# EasyEDA Pro project _天猛星MSPM0电赛1.0_2025-07-10.epro, schematic Schematic1
Board Name: Board1; Create Date: 2025-07-05; Page Name: P1; Project Name: 天猛星MSPM0电赛; Schematic Name: Schematic1; Update Date: 2025-07-05; Company: 嘉立创EDA; Page Size: A4; Version: V1.0
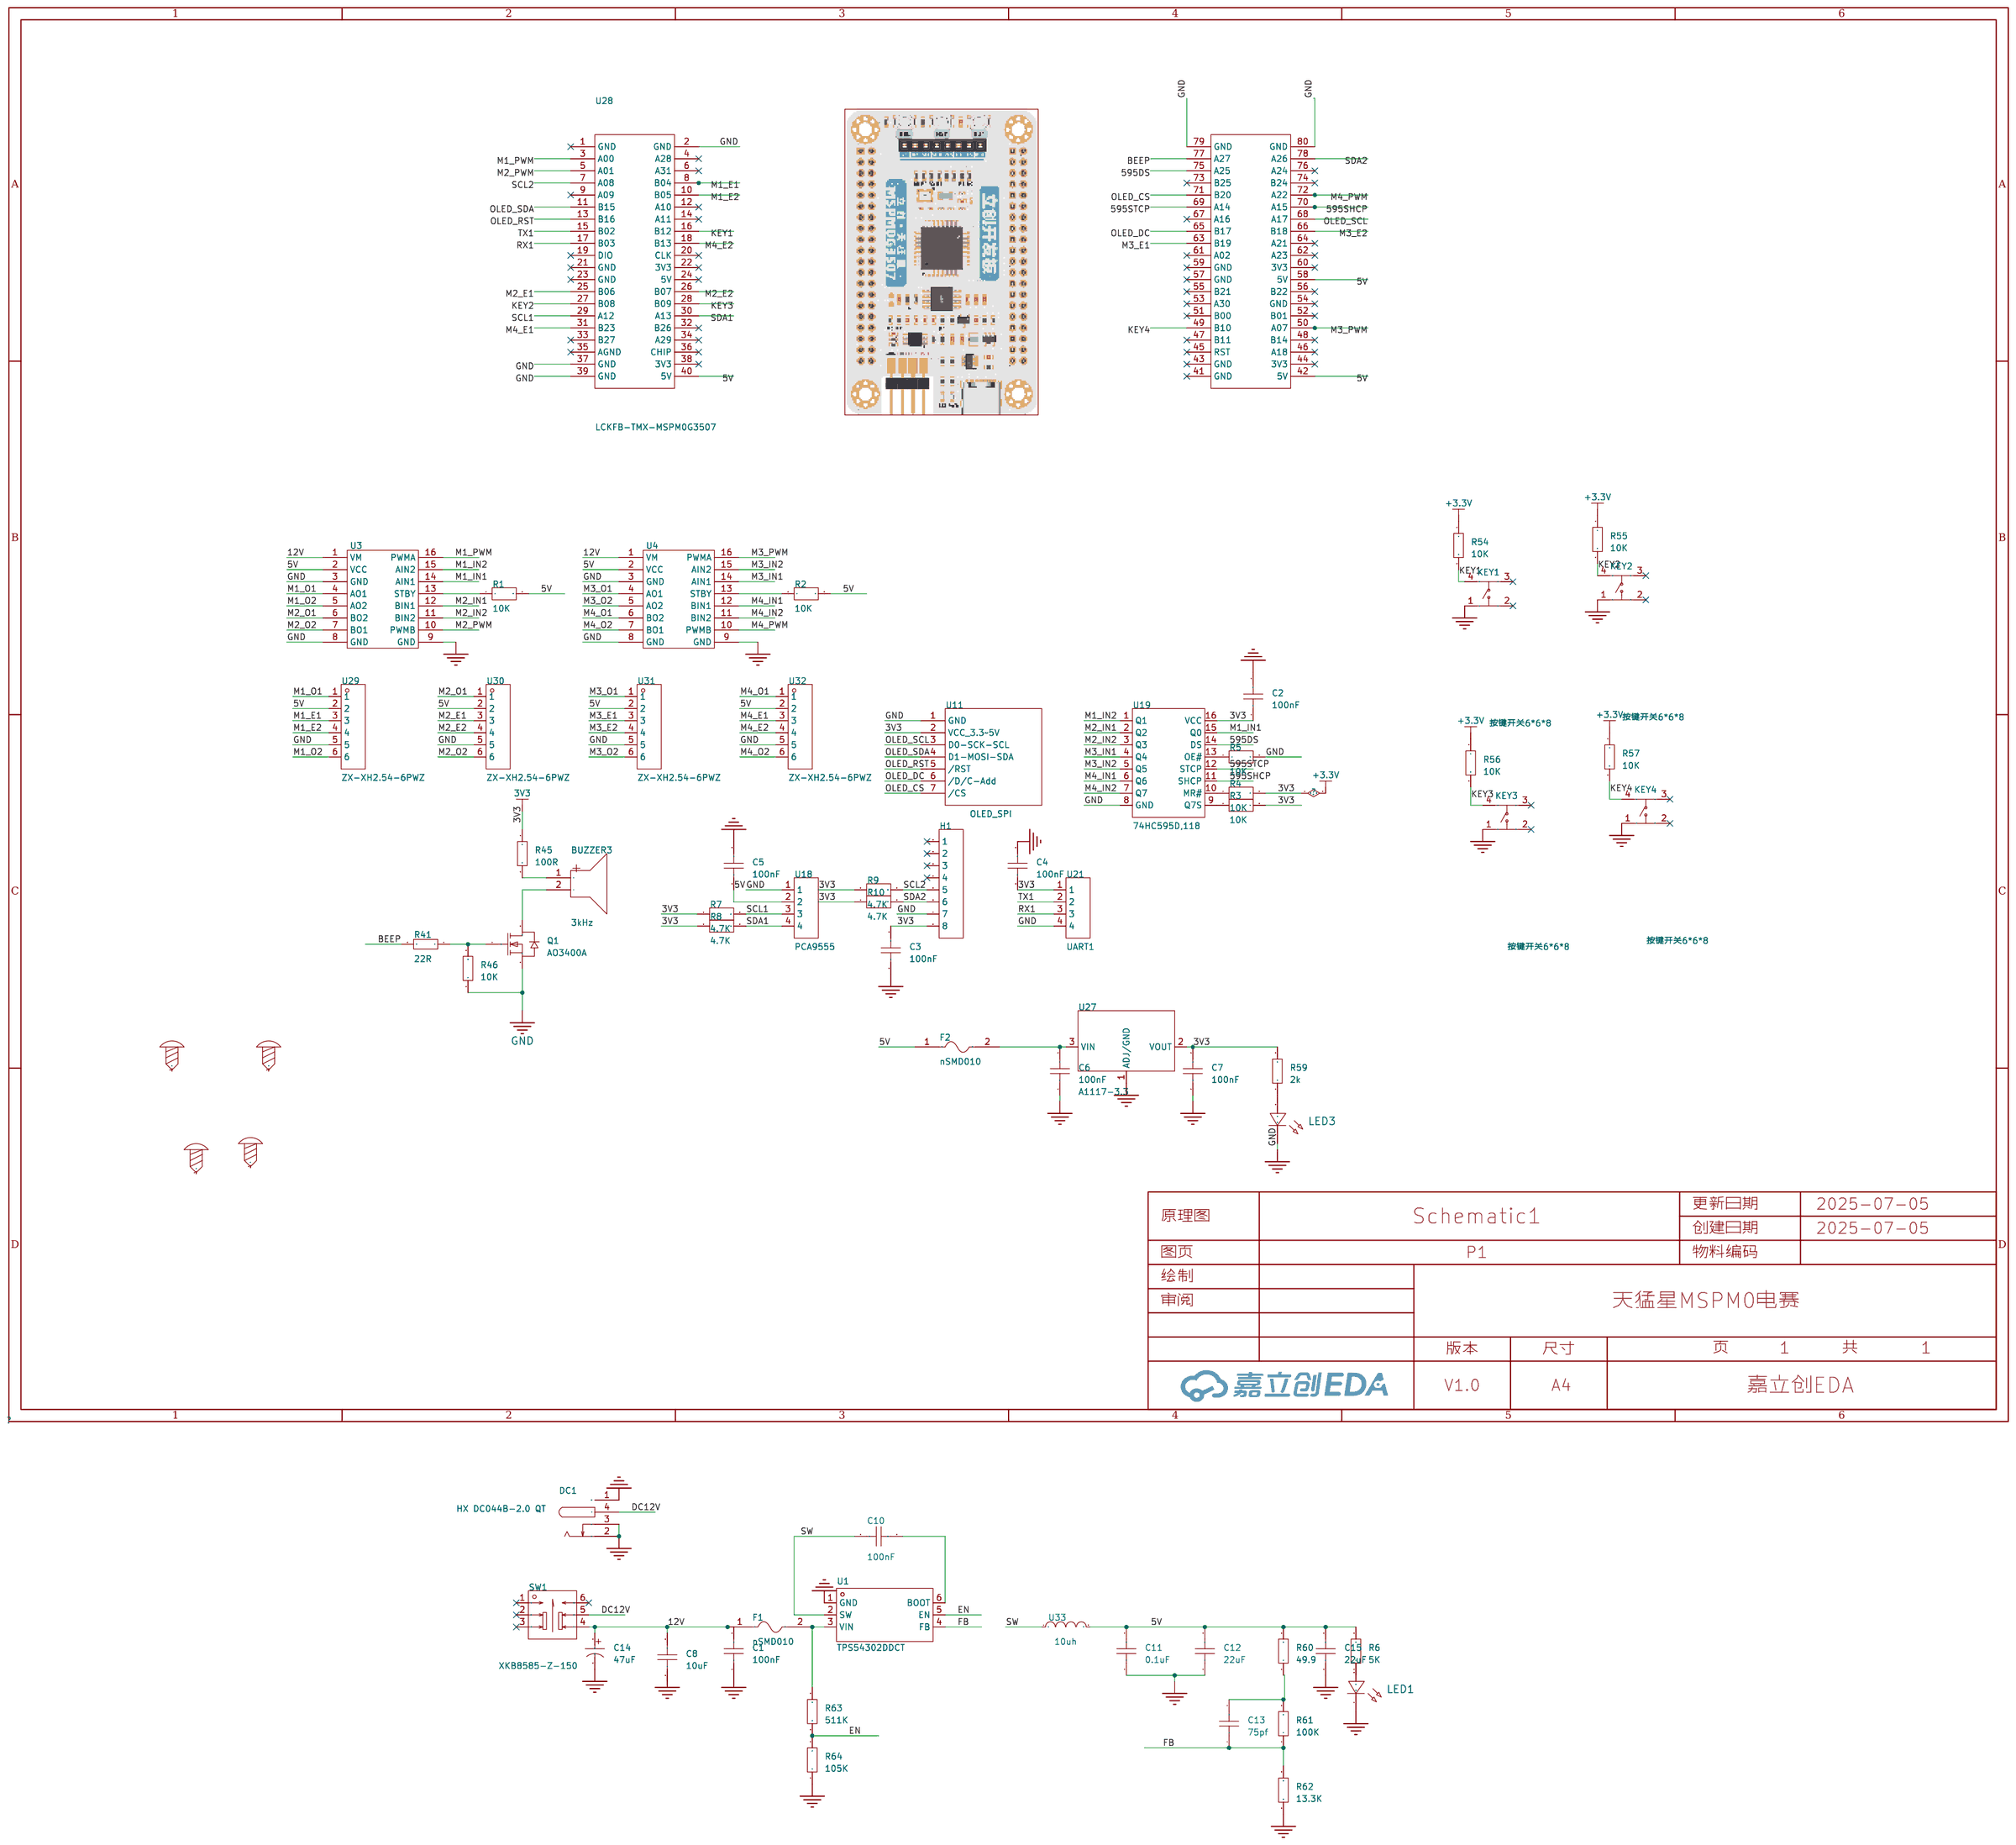
[diagram p0: schematic sheet]

## Parts
BUZZER3  3kHz  [BUZ-TH_BD9.0-P5.00-D0.6-FD]
C1  100nF  [C0805]
C2  100nF  [C0603]
C3  100nF  [C0603]
C4  100nF  [C0603]
C5  100nF  [C0603]
C6  100nF  [C0603]
C7  100nF  [C0603]
C8  10uF  [C0805]
C10  100nF  [C0805]
C11  0.1uF  [C0603]
C12  22uF  [C0603]
C13  75pf  [C0805]
C14  47uF  [CAP-TH_BD5.0-P2.00-D0.8-FD]
C15  22uF  [C0603]
DC1  HX DC044B-2.0 QT  [DC-IN-TH_HX-DC044B-2.0-QT]
F1  nSMD010  [F1206]
F2  nSMD010  [F1206]
H1  -  [HDR-TH_8P-P2.54-V-F-1]
KEY1  按键开关6*6*8  [KEY-TH_4P-L6.0-W6.0-P4.50-LS7.5]
KEY2  按键开关6*6*8  [KEY-TH_4P-L6.0-W6.0-P4.50-LS7.5]
KEY3  按键开关6*6*8  [KEY-TH_4P-L6.0-W6.0-P4.50-LS7.5]
KEY4  按键开关6*6*8  [KEY-TH_4P-L6.0-W6.0-P4.50-LS7.5]
LED1  -  [LED_0805]
LED3  -  [LED_0603]
Q1  AO3400A  [SOT-23-3_L2.9-W1.3-P1.90-LS2.4-BR]
R1  10K  [C0603]
R2  10K  [C0603]
R3  10K  [C0603]
R4  10K  [C0603]
R5  10K  [C0603]
R6  5K  [R0805]
R7  4.7K  [C0603]
R8  4.7K  [C0603]
R9  4.7K  [C0603]
R10  4.7K  [C0603]
R41  22R  [R0603]
R45  100R  [R0603]
R46  10K  [R0603]
R54  10K  [R0603]
R55  10K  [R0603]
R56  10K  [R0603]
R57  10K  [R0603]
R59  2k  [R0603]
R60  49.9  [R0805]
R61  100K  [R0805]
R62  13.3K  [R0805]
R63  511K  [R0805]
R64  105K  [R0805]
SCREW1  -  [M3螺丝]
SCREW2  -  [M3螺丝]
SCREW3  -  [M3螺丝]
SCREW4  -  [M3螺丝]
SW1  XKB8585-Z-150  [SW-TH_6P-L8.5-W8.5-P2.50-LS5.4-BL-1]
U1  TPS54302DDCT  [TSOT-23-6_L2.9-W1.6-P0.95-LS2.8-BR]
U3  -  [TB6612]
U4  -  [TB6612]
U11  OLED_SPI  [0.96OLED_7P]
U18  PCA9555  [CONN-TH_4P-P2.50-XH2.54-4P]
U19  74HC595D,118  [SOIC-16_L9.9-W3.9-P1.27-LS6.0-BL]
U21  UART1  [CONN-TH_4P-P2.50-XH2.54-4P]
U27  A1117-3.3  [SOT-223-3_L6.5-W3.4-P2.30-LS7.0-BR-1]
U28  LCKFB-TMX-MSPM0G3507  [COMM-TH_LCKFB-TMX-MSPM0G3507]
U29  ZX-XH2.54-6PWZ  [CONN-TH_6P-P2.50_ZX-XH2.54-6PWZ]
U30  ZX-XH2.54-6PWZ  [CONN-TH_6P-P2.50_ZX-XH2.54-6PWZ]
U31  ZX-XH2.54-6PWZ  [CONN-TH_6P-P2.50_ZX-XH2.54-6PWZ]
U32  ZX-XH2.54-6PWZ  [CONN-TH_6P-P2.50_ZX-XH2.54-6PWZ]
U33  10uh  [IND-SMD_L4.5-W4.0_SCD0403T]

## Library data of the parts
BUZZER3 = HNB09A03: 驱动方式:有源(内含驱动线路);构造类型:电磁式;频率:3kHz;声压(SPL):85dB;; LCSC Part Name: 电磁式有源一体蜂鸣器HNB09A03; Supplier Part: C96102; Manufacturer: 华能; Supplier Footprint: 插件,D=9mm; JLCPCB Part Class: 扩展库; Datasheet: https://atta.szlcsc.com/upload/public/pdf/source/20241128/61C4C8C3938BB25F7C38FBE94CCE8DCF.pdf; Supplier: LCSC; Driver Circuitry: 有源(内含驱动线路); Technology: 电磁式; Voltage - Supply: 1.5V~4.5V; Current Consumption: 30mA; Sound Pressure Level(SPL): 85dB; Diameter(φD): 9mm; Height: 5.5mm; Operating Temperature: -20℃~+70℃
C1 C8 C10 C13 = CAP_0805: Supplier Footprint: 0805
C2-C7 C11 C12 C15 = CAP_0603: Supplier Footprint: 0603
C14 = EWH1VM470D11OT: 容值:47uF;精度:±20%;额定电压:35V;纹波电流:90mA@120Hz;等效串联电阻:-;; LCSC Part Name: 47uF ±20% 35V; Supplier Part: C105335; Manufacturer: AISHI(艾华集团); Supplier Footprint: 插件,D5xL11mm; Datasheet: https://atta.szlcsc.com/upload/public/pdf/source/20200106/C481308_16D735F9103482ADD8491C667D201AFA.pdf; Supplier: LCSC; Tolerance: ±20%; Rated Voltage: 35V; Ripple Current: 90mA@120Hz; Lead Spacing: 2mm; φD: 5mm; L: 11mm; Lifetime @ Temp: 2000hrs@105℃
DC1 = HX DC044B-2.0 QT: 连接器类型:DC电源插座;安装方式:弯插;触点内径:2mm;触点外径:5.8mm;额定电压:30V;触头材质:-;触头镀层:-;工作温度范围:-;焊接温度(最大值):-;; LCSC Part Name: DC电源插座 内径:2mm 外径:5.8mm; Supplier Part: C41375962; Manufacturer: hanxia(韩下); Supplier Footprint: 插件; Datasheet: https://atta.szlcsc.com/upload/public/pdf/source/20240830/7C11609858F94C5A32999C6C6EF5F6BF.pdf; Supplier: LCSC; Connector Type: DC电源插座; Mounting Style: 弯插; Inside Contact Diameter: 2mm; Outside Contact Diameter: 5.8mm; Voltage Rating (Max): 30V
F1 F2 = nSMD010: 耐压:60V;最大电流:40A;保持电流(Ih):100mA;跳闸电流:250mA;; LCSC Part Name: 0.10A 60V 自恢复保险丝; Supplier Part: C70065; Manufacturer: 台湾陆海; Supplier Footprint: 1206; Datasheet: https://atta.szlcsc.com/upload/public/pdf/source/20230404/ADB19886462D98F83AD677B1F8114E76.pdf; Supplier: LCSC; Voltage - Max: 60V; Current - Max: 40A; Hold Current: 100mA; Trip Current: 250mA; Power Dissipation: -；-；-；-; Operating Temperature: -40℃~+85℃
H1 = HDR-F_2.54_1x8P: Supplier Part: C27438; Supplier Footprint: 插件
KEY1-KEY4 = 按键开关6*6*8: LCSC Part Name: 按键开关6*6*8   直插; Supplier Part: C59982; Supplier Footprint: 插件; JLCPCB Part Class: 扩展库; Supplier: LCSC
LED1 = LED_0805-R: Supplier Footprint: 0805
LED3 = LED_0603-R: Supplier Footprint: 0603
Q1 = AO3400A_C20917: 类型:1个N沟道;漏源电压(Vdss):30V;连续漏极电流(Id):5.7A;导通电阻(RDS(on)@Vgs,Id):26.5mΩ@10V,5.7A;功率(Pd):1.4W;阈值电压(Vgs(th)@Id):1.5V@250uA;; LCSC Part Name: 1个N沟道 耐压:30V 电流:5.7A; Supplier Part: C20917; Manufacturer: AOS; Supplier Footprint: SOT-23-3L; JLCPCB Part Class: 基础库; Datasheet: https://atta.szlcsc.com/upload/public/pdf/source/20140107/1457706668533.pdf; Supplier: LCSC; Type: 1个N沟道; Drain Source Voltage (Vdss): 30V; Continuous Drain Current (Id): 5.7A; Drain Source On Resistance (RDS(on)@Vgs,Id): 26.5mΩ@10V,5.7A; Power Dissipation (Pd): 1.4W; Gate Threshold Voltage (Vgs(th)@Id): 1.5V@250uA; Total Gate Charge (Qg@Vgs): 7nC@4.5V; Input Capacitance (Ciss@Vds): 630pF@15V; Operating Temperature: -55℃~+150℃@(Tj)
R1-R5 R7-R10 = RGT1608P-4990-B-T5: 电阻类型:薄膜电阻;阻值:499Ω;精度:±0.1%;功率:62.5mW;最大工作电压:100V;温度系数:±25ppm/℃;; LCSC Part Name: 薄膜电阻 499Ω ±0.1% 62.5mW; Supplier Part: C2083102; Manufacturer: SUSUMU; Supplier Footprint: 0603; JLCPCB Part Class: 扩展库; Datasheet: https://atta.szlcsc.com/upload/public/pdf/source/20210602/FAF6903AD06801EB9B5BD9535AC54790.pdf; Supplier: LCSC; Type: 薄膜电阻; Tolerance: ±0.1%; Power(Watts): 62.5mW; Overload Voltage (Max): 100V; Temperature Coefficient: ±25ppm/℃; Operating Temperature Range: -55℃~+175℃
R6 R60-R64 = Res_0805: Supplier Footprint: 0805
R41 R45 R46 R54-R57 R59 = Res_0603: Supplier Footprint: 0603
SCREW1-SCREW4 = M3螺丝: Supplier Footprint: 插件
SW1 = XKB8585-Z-150: 电路结构:-;自锁/无锁:自锁;安装方式:直插;触点电流:100mA;额定电压 (AC):250V;额定电压 (DC):30V;带灯:不带;作用力:160gf;机械寿命:10万次;; LCSC Part Name: 按键开关   六脚 内扣 有声自锁; Supplier Part: C318850; Manufacturer: XKB Connectivity(中国星坤); Supplier Footprint: 插件; JLCPCB Part Class: 扩展库; Datasheet: https://atta.szlcsc.com/upload/public/pdf/source/20200227/C318850_BEC742BC33DEE736D7E5FB22B903A157.pdf; Supplier: LCSC; Self Lock / No Lock: 自锁; Actuator Style: 方形按钮; Mounting Style: 直插; Contact Current: 100mA; Voltage Rating (AC): 250V; Voltage Rating (DC): 30V; Insulation Resistance: 100MΩ; Actuator/Cap Color: 白色; With Lamp: 不带; Pin Style: PC引脚; Operating Force: 160gf; Operating Temperature: -15℃~+55℃; Mechanical Life: 10万次
U1 = TPS54302DDCT: 功能类型:降压型;输出类型:可调;工作电压:4.5V~28V;输出电压:596mV~28V;输出电流:3A;; LCSC Part Name: 4.5V至28V输入,3A输出,低EMI同步降压转换器; Supplier Part: C129370; Manufacturer: TI(德州仪器); Supplier Footprint: TSOT-23-6; JLCPCB Part Class: 扩展库; Datasheet: https://www.ti.com/cn/lit/gpn/tps54302; Supplier: LCSC; Function: 降压型; Output Type: 可调; Input Voltage: 4.5V~28V; Output Voltage: 596mV~28V; Output Current: 3A; Switching Frequency: 400kHz; Operating Temperature: -40℃~+125℃@(TJ); Synchronous Rectification: 是; Number of Outputs: 1; Topology: 降压式; Switch tube (built-in/external): 内置
U3 U4 = TB6612
U11 = OLED_7P: Pin Type: IN
U18 U21 = XH2.54_4P_直插: Supplier Part: C9900008616; Supplier Footprint: XH2.54_4P; JLCPCB Part Class: 扩展库; Supplier: LCSC
U19 = 74HC595D,118: 功能:串行至串行或并行;电源电压:2V~6V;元件数:1;每个元件位数:8;; LCSC Part Name: 三态输出 串行至串行或并行移位寄存器; Supplier Part: C5947; Manufacturer: Nexperia(安世); Supplier Footprint: SOIC-16; JLCPCB Part Class: 基础库; Datasheet: https://atta.szlcsc.com/upload/public/pdf/source/20240724/C3A3241CA190230F407C83CEC4244600.pdf; Supplier: LCSC; Function: 串行至串行或并行; Supply Voltage: 2V~6V; Number of Elements: 1; Number of Bits per Element: 8; Output Type: 三态; Series: 74HC; Operating Temperature: -40℃~+125℃
U27 = A1117-3.3: 输出电流:1A;; LCSC Part Name: AMS1117-3.3; Supplier Part: C7432020; Manufacturer: IDCHIP(英锐芯); Supplier Footprint: SOT-223; JLCPCB Part Class: 扩展库; Datasheet: https://atta.szlcsc.com/upload/public/pdf/source/20230625/435FEEFA02C0FE449E7397A11F8448E0.pdf; Supplier: LCSC; Output Current: 1A; Features: 热关断(TSD)；过流保护(OCP)
U28 = LCKFB-TMX-MSPM0G3507: LCSC Part Name: 5件套 立创·天猛星MSPM0G3507开发板; Supplier Part: C42378531; Manufacturer: 立创开发板; Datasheet: https://atta.szlcsc.com/upload/public/pdf/source/20241209/800332349277522348D9357AB5109808.pdf; Supplier: LCSC
U29-U32 = ZX-XH2.54-6PWZ: 插针结构:1x6P;间距:2.5mm;安装方式:弯插;参考系列:XH;总PIN数:6P;排数:1;每排PIN数:6;行距:-;额定电流:3A;触头材质:黄铜;触头镀层:锡;工作温度范围:-25℃~+85℃;; LCSC Part Name: 1x6P 间距:2.5mm 弯插 系列:XH; Supplier Part: C7429645; Manufacturer: Megastar(兆星); Supplier Footprint: 弯插,P=2.5mm; JLCPCB Part Class: 扩展库; Datasheet: https://atta.szlcsc.com/upload/public/pdf/source/20230619/9057EB94260093B1525D11E652DE2D7A.pdf; Supplier: LCSC; Pins Structure: 1x6P; Pitch: 2.5mm; Mounting Type: 弯插; Reference Series: XH; Number of Pins: 6P; Number of Rows: 1; Number of PINs Per Row: 6; Rated Current: 3A; Contact Material: 黄铜; Contact Plating: 锡; Operating Temperature: -25℃~+85℃; Rated Voltage (Max): 250V; Plastic Material: PA66; Flame Retardant Rating: UL94V-0; Color: 白色; Z-Height of the Board: 5.9mm; X-Length of Bottom Edge on Board (Spacing Line): 17.5mm; Y-Width of Bottom Edge on Board: 7.32mm
U33 = L-03/CD43_C9900011087: LCSC Part Name: L-03/CD43; Supplier Part: C9900011087; Supplier Footprint: 10uH; JLCPCB Part Class: 扩展库; Supplier: LCSC

## Nets
5V: C5.2 C11.2 C12.2 C15.2 F2.1 R1.2 R2.2 R6.2 R60.2 U3.2(VCC) U4.2(VCC) U18.2 U28.40(5V) U28.42(5V) U28.58(5V) U29.2 U30.2 U31.2 U32.2 U33.2
12V: C1.2 C8.2 C14.1 F1.1 SW1.4 U3.1(VM) U4.1(VM)
+3.3V: C2.1 C3.2 C4.1 C7.2 H1.8 R3.2 R4.2 R7.1 R8.1 R9.1 R10.1 R45.1 R54.1 R55.1 R56.1 R57.1 R59.2 U11.2(VCC 3.3~5V) U19.16(VCC) U21.1 U27.2(VOUT)
GND: C1.1 C2.2 C3.1 C4.2 C5.1 C6.1 C7.1 C8.1 C11.1 C12.1 C14.2 C15.1 DC1.1(SHELL) DC1.2 DC1.3 H1.7 KEY1.1 KEY2.1 KEY3.1 KEY4.1 LED1.1(C) LED3.1(C) Q1.2(S) R5.2 R46.1 R62.1 R64.1 U1.1(GND) U3.3(GND) U3.8(GND) U3.9(GND) U4.3(GND) U4.8(GND) U4.9(GND) U11.1(GND) U18.1 U19.8(GND) U21.4 U27.1(ADJ/GND) U28.2(GND) U28.37(GND) U28.39(GND) U28.79(GND) U28.80(GND) U29.5 U30.5 U31.5 U32.5
595DS: U19.14(DS) U28.75(A25)
595SHCP: U19.11(SHCP) U28.70(A15)
595STCP: U19.12(STCP) U28.69(A14)
BEEP: R41.2 U28.77(A27)
DC12V: DC1.4 SW1.5
EN: R63.1 R64.2 U1.5(EN)
FB: C13.1 R61.1 R62.2 U1.4(FB)
KEY1: KEY1.4 R54.2 U28.16(B12)
KEY2: KEY2.4 R55.2 U28.27(B08)
KEY3: KEY3.4 R56.2 U28.28(B09)
KEY4: KEY4.4 R57.2 U28.49(B10)
M1_E1: U28.8(B04) U29.3
M1_E2: U28.10(B05) U29.4
M1_IN1: U3.14(AIN1) U19.15(Q0)
M1_IN2: U3.15(AIN2) U19.1(Q1)
M1_O1: U3.4(AO1) U29.1
M1_O2: U3.5(AO2) U29.6
M1_PWM: U3.16(PWMA) U28.3(A00)
M2_E1: U28.25(B06) U30.3
M2_E2: U28.26(B07) U30.4
M2_IN1: U3.12(BIN1) U19.2(Q2)
M2_IN2: U3.11(BIN2) U19.3(Q3)
M2_O1: U3.6(BO2) U30.1
M2_O2: U3.7(BO1) U30.6
M2_PWM: U3.10(PWMB) U28.5(A01)
M3_E1: U28.63(B19) U31.3
M3_E2: U28.66(B18) U31.4
M3_IN1: U4.14(AIN1) U19.4(Q4)
M3_IN2: U4.15(AIN2) U19.5(Q5)
M3_O1: U4.4(AO1) U31.1
M3_O2: U4.5(AO2) U31.6
M3_PWM: U4.16(PWMA) U28.50(A07)
M4_E1: U28.31(B23) U32.3
M4_E2: U28.18(B13) U32.4
M4_IN1: U4.12(BIN1) U19.6(Q6)
M4_IN2: U4.11(BIN2) U19.7(Q7)
M4_O1: U4.6(BO2) U32.1
M4_O2: U4.7(BO1) U32.6
M4_PWM: U4.10(PWMB) U28.72(A22)
OLED_CS: U11.7(/CS) U28.71(B20)
OLED_DC: U11.6(/D/C-Add) U28.65(B17)
OLED_RST: U11.5(/RST) U28.13(B16)
OLED_SCL: U11.3(D0-SCK-SCL) U28.68(A17)
OLED_SDA: U11.4(D1-MOSI-SDA) U28.11(B15)
RX1: U21.3 U28.17(B03)
SCL1: R7.2 U18.3 U28.29(A12)
SCL2: H1.5 R9.2 U28.7(A08)
SDA1: R8.2 U18.4 U28.30(A13)
SDA2: H1.6 R10.2 U28.78(A26)
SW: C10.1 U1.2(SW) U33.1
TX1: U21.2 U28.15(B02)
$1N2097: C6.2 F2.2 U27.3(VIN)
$1N3300: R1.1 U3.13(STBY)
$1N3306: R2.1 U4.13(STBY)
$1N3954: R3.1 U19.9(Q7S)
$1N3999: R4.1 U19.10(MR#)
$1N4038: R5.1 U19.13(OE#)
$1N7178: Q1.1(G) R41.1 R46.2
$1N14720: BUZZER3.1(+) R45.2
$1N14723: BUZZER3.2(-) Q1.3(D)
$1N15095: LED3.2(A) R59.1
$1N22679: C10.2 U1.6(BOOT)
$1N22686: C13.2 R60.1 R61.2
$1N22696: LED1.2(A) R6.1
$1N22948: F1.2 R63.2 U1.3(VIN)

Not connected (* = marked no-connect by the designer): H1 1* 2* 3* 4*; KEY1 2* 3*; KEY2 2* 3*; KEY3 2* 3*; KEY4 2* 3*; SCREW1 1; SCREW2 1; SCREW3 1; SCREW4 1; SW1 1* 2* 3* 6*; U28 1(GND)* 4(A28)* 6(A31)* 9(A09)* 12(A10)* 14(A11)* 19(DIO)* 20(CLK)* 21(GND)* 22(3V3)* 23(GND)* 24(5V)* 32(B26)* 33(B27)* 34(A29)* 35(AGND)* 36(CHIP)* 38(3V3)* 41(GND)* 43(GND)* 44(3V3)* 45(RST)* 46(A18)* 47(B11)* 48(B14)* 51(B00)* 52(B01)* 53(A30)* 54(GND)* 55(B21)* 56(B22)* 57(GND)* 59(GND)* 60(3V3)* 61(A02)* 62(A23)* 64(A21)* 67(A16)* 73(B25)* 74(B24)* 76(A24)*
